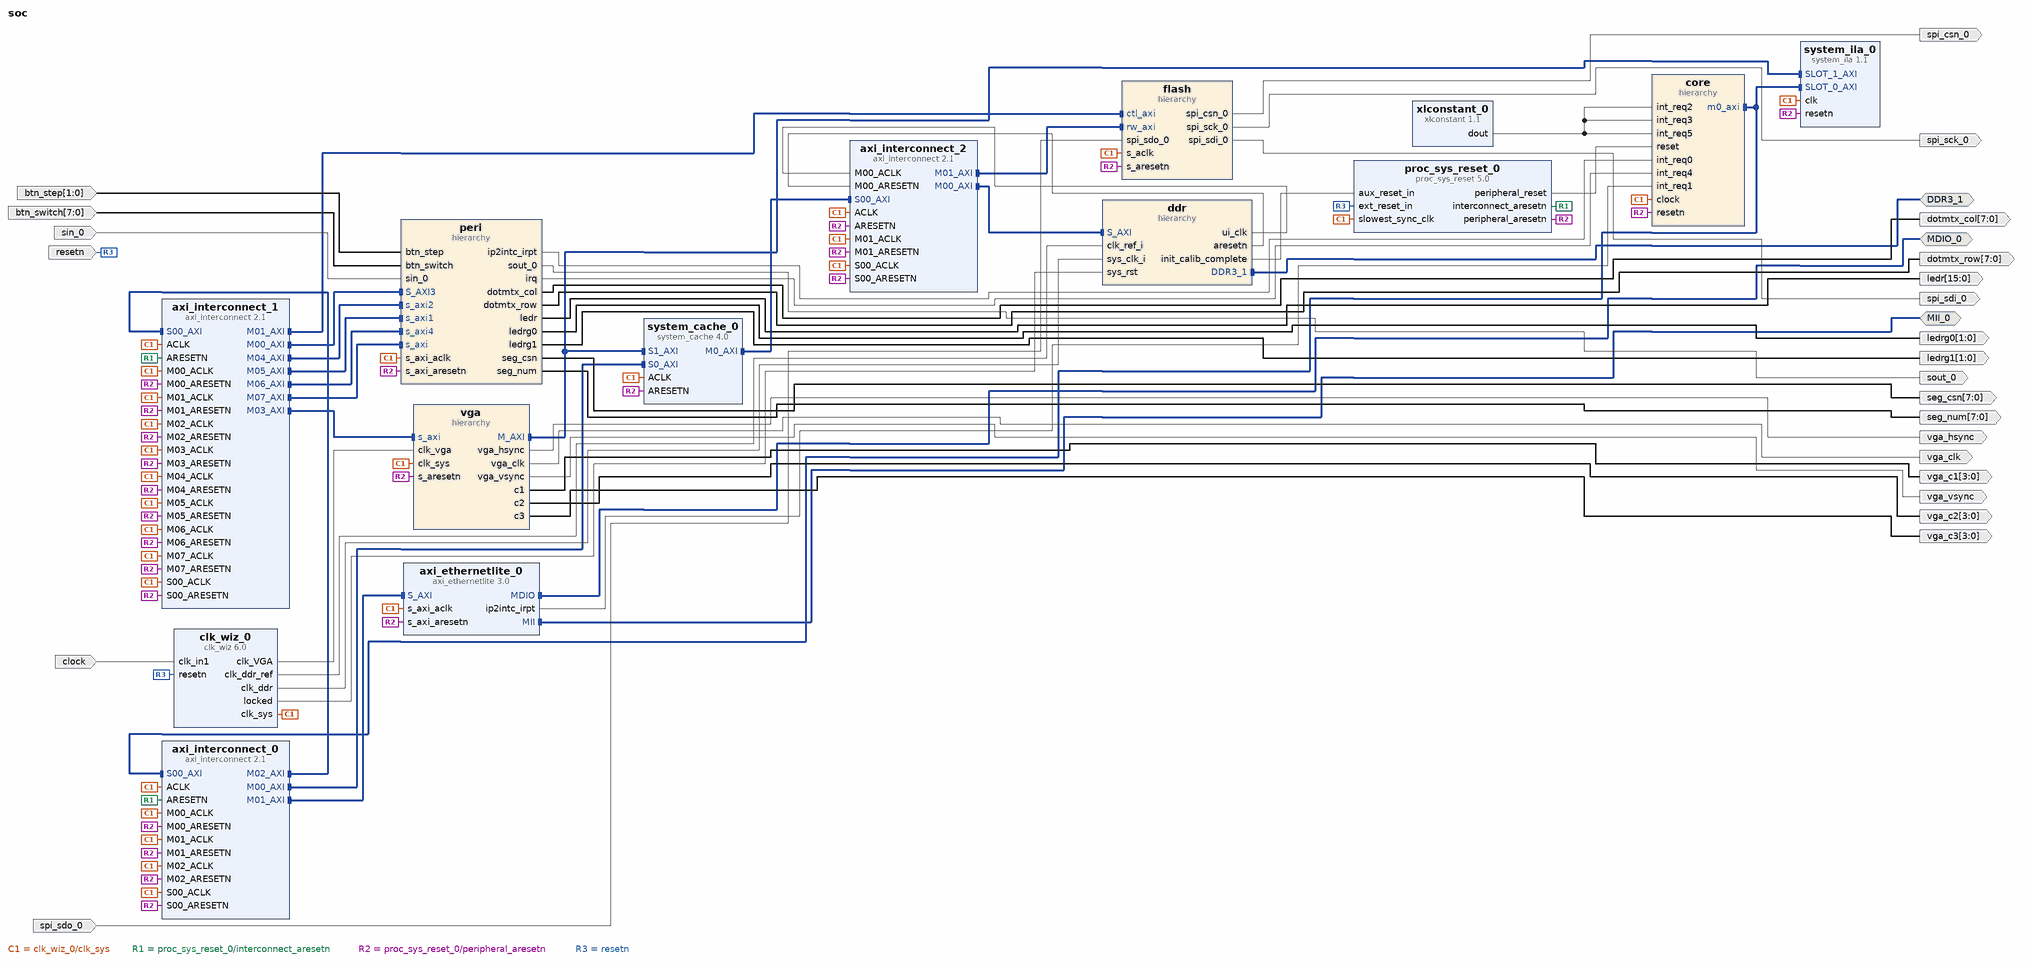
[diagram p0: block diagram of the top level]
# Vivado block design soc, xc7a200tfbg676-2, Vivado 2018.1
create_bd_design soc

create_bd_intf_port -mode Master -vlnv xilinx.com:interface:ddrx_rtl:1.0 DDR3_1
create_bd_intf_port -mode Master -vlnv xilinx.com:interface:mdio_rtl:1.0 MDIO_0
create_bd_intf_port -mode Master -vlnv xilinx.com:interface:mii_rtl:1.0 MII_0
create_bd_port -dir O vga_hsync
create_bd_port -dir O vga_clk
create_bd_port -dir O vga_vsync
create_bd_port -dir O sout_0
create_bd_port -dir I -from 1 -to 0 btn_step
create_bd_port -dir I -from 7 -to 0 btn_switch
create_bd_port -dir I -type clk clock
create_bd_port -dir O -from 7 -to 0 dotmtx_col
create_bd_port -dir O -from 7 -to 0 dotmtx_row
create_bd_port -dir O spi_csn_0
create_bd_port -dir O spi_sck_0
create_bd_port -dir O spi_sdi_0
create_bd_port -dir O -from 15 -to 0 ledr
create_bd_port -dir O -from 1 -to 0 ledrg0
create_bd_port -dir O -from 1 -to 0 ledrg1
create_bd_port -dir I -type rst resetn
create_bd_port -dir O -from 7 -to 0 seg_csn
create_bd_port -dir O -from 7 -to 0 seg_num
create_bd_port -dir I sin_0
create_bd_port -dir I spi_sdo_0
create_bd_port -dir O -from 3 -to 0 vga_c1
create_bd_port -dir O -from 3 -to 0 vga_c2
create_bd_port -dir O -from 3 -to 0 vga_c3

create_bd_cell -type ip -vlnv xilinx.com:ip:axi_ethernetlite:3.0 axi_ethernetlite_0
set_property -dict {CONFIG.C_S_AXI_PROTOCOL AXI4} [get_bd_cells axi_ethernetlite_0]
create_bd_cell -type ip -vlnv xilinx.com:ip:axi_interconnect:2.1 axi_interconnect_0
set_property -dict {CONFIG.NUM_MI 3 CONFIG.STRATEGY 2 CONFIG.S00_HAS_DATA_FIFO 2} [get_bd_cells axi_interconnect_0]
create_bd_cell -type ip -vlnv xilinx.com:ip:axi_interconnect:2.1 axi_interconnect_1
set_property -dict {CONFIG.NUM_MI 8 CONFIG.STRATEGY 1 CONFIG.ENABLE_ADVANCED_OPTIONS 1} [get_bd_cells axi_interconnect_1]
create_bd_cell -type ip -vlnv xilinx.com:ip:axi_interconnect:2.1 axi_interconnect_2
set_property -dict [list \
  CONFIG.STRATEGY 2 \
  CONFIG.ENABLE_ADVANCED_OPTIONS 0 \
  CONFIG.S00_HAS_DATA_FIFO 2 \
] [get_bd_cells axi_interconnect_2]
create_bd_cell -type ip -vlnv xilinx.com:ip:clk_wiz:6.0 clk_wiz_0
set_property -dict [list \
  CONFIG.CLKOUT1_USED true \
  CONFIG.CLKOUT2_USED true \
  CONFIG.CLKOUT3_USED true \
  CONFIG.CLKOUT4_USED true \
  CONFIG.NUM_OUT_CLKS 4 \
  CONFIG.CLK_OUT1_PORT clk_sys \
  CONFIG.CLK_OUT2_PORT clk_ddr_ref \
  CONFIG.CLK_OUT3_PORT clk_ddr \
  CONFIG.CLK_OUT4_PORT clk_VGA \
  CONFIG.CLKOUT1_REQUESTED_OUT_FREQ 50.000 \
  CONFIG.CLKOUT2_REQUESTED_OUT_FREQ 200.000 \
  CONFIG.CLKOUT3_REQUESTED_OUT_FREQ 100.000 \
  CONFIG.CLKOUT4_REQUESTED_OUT_FREQ 40 \
  CONFIG.RESET_PORT resetn \
  CONFIG.MMCM_DIVCLK_DIVIDE 1 \
  CONFIG.MMCM_CLKOUT0_DIVIDE_F 20.000 \
  CONFIG.MMCM_CLKOUT1_DIVIDE 5 \
  CONFIG.MMCM_CLKOUT2_DIVIDE 10 \
  CONFIG.MMCM_CLKOUT3_DIVIDE 25 \
  CONFIG.RESET_TYPE ACTIVE_LOW \
  CONFIG.CLKOUT1_JITTER 151.636 \
  CONFIG.CLKOUT2_JITTER 114.829 \
  CONFIG.CLKOUT2_PHASE_ERROR 98.575 \
  CONFIG.CLKOUT3_JITTER 130.958 \
  CONFIG.CLKOUT3_PHASE_ERROR 98.575 \
  CONFIG.CLKOUT4_JITTER 159.371 \
  CONFIG.CLKOUT4_PHASE_ERROR 98.575 \
] [get_bd_cells clk_wiz_0]
create_bd_cell -type hier core
create_bd_cell -type hier ddr
create_bd_cell -type hier flash
create_bd_cell -type hier peri
create_bd_cell -type ip -vlnv xilinx.com:ip:proc_sys_reset:5.0 proc_sys_reset_0
create_bd_cell -type ip -vlnv xilinx.com:ip:system_cache:4.0 system_cache_0
set_property -dict [list \
  CONFIG.C_ENABLE_CTRL 0 \
  CONFIG.C_NUM_OPTIMIZED_PORTS 2 \
  CONFIG.C_NUM_WAYS 4 \
  CONFIG.C_CACHE_DATA_WIDTH 128 \
  CONFIG.C_CACHE_SIZE 524288 \
  CONFIG.C_M0_AXI_DATA_WIDTH 128 \
  CONFIG.C_M1_AXI_DATA_WIDTH 32 \
  CONFIG.C_M2_AXI_DATA_WIDTH 32 \
  CONFIG.C_M3_AXI_DATA_WIDTH 32 \
] [get_bd_cells system_cache_0]
create_bd_cell -type ip -vlnv xilinx.com:ip:system_ila:1.1 system_ila_0
set_property -dict [list \
  CONFIG.C_DATA_DEPTH 4096 \
  CONFIG.C_PROBE0_MU_CNT 2 \
  CONFIG.ALL_PROBE_SAME_MU_CNT 2 \
  CONFIG.C_NUM_MONITOR_SLOTS 2 \
] [get_bd_cells system_ila_0]
create_bd_cell -type hier vga
create_bd_cell -type ip -vlnv xilinx.com:ip:xlconstant:1.1 xlconstant_0
set_property -dict {CONFIG.CONST_VAL 0} [get_bd_cells xlconstant_0]

# ---- hierarchy /core ----
current_bd_instance /core
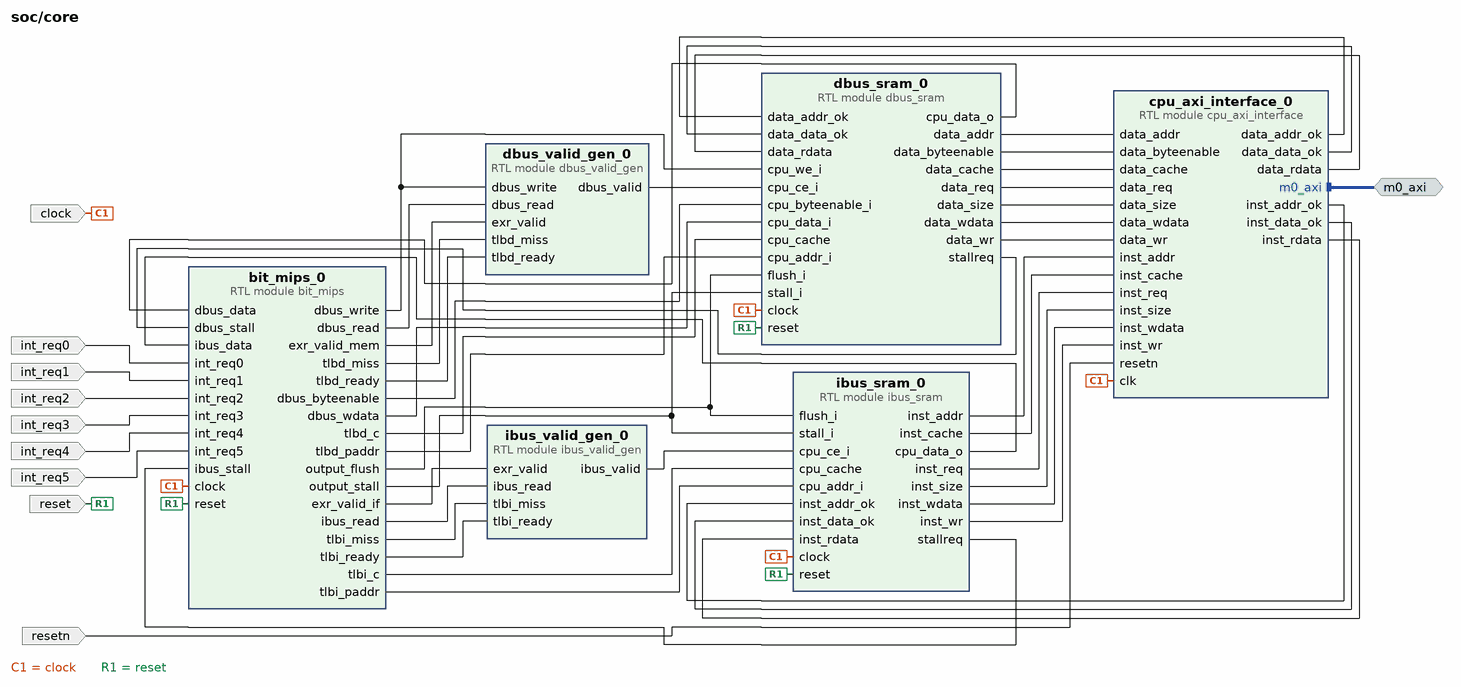
[diagram p1: block diagram inside /core]
create_bd_intf_pin -mode Master -vlnv xilinx.com:interface:aximm_rtl:1.0 m0_axi
create_bd_pin -dir I -type clk clock
create_bd_pin -dir I int_req0
create_bd_pin -dir I int_req1
create_bd_pin -dir I int_req2
create_bd_pin -dir I int_req3
create_bd_pin -dir I int_req4
create_bd_pin -dir I int_req5
create_bd_pin -dir I -type rst reset
create_bd_pin -dir I -type rst resetn

create_bd_cell -type module -reference bit_mips bit_mips_0
create_bd_cell -type module -reference cpu_axi_interface cpu_axi_interface_0
create_bd_cell -type module -reference dbus_sram dbus_sram_0
create_bd_cell -type module -reference dbus_valid_gen dbus_valid_gen_0
create_bd_cell -type module -reference ibus_sram ibus_sram_0
create_bd_cell -type module -reference ibus_valid_gen ibus_valid_gen_0

# ---- hierarchy /ddr ----
current_bd_instance /ddr
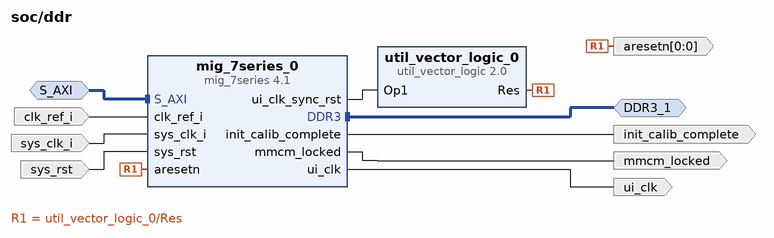
[diagram p2: block diagram inside /ddr]
create_bd_intf_pin -mode Master -vlnv xilinx.com:interface:ddrx_rtl:1.0 DDR3_1
create_bd_intf_pin -mode Slave -vlnv xilinx.com:interface:aximm_rtl:1.0 S_AXI
create_bd_pin -dir O -from 0 -to 0 -type rst aresetn
create_bd_pin -dir I -type clk clk_ref_i
create_bd_pin -dir O init_calib_complete
create_bd_pin -dir O mmcm_locked
create_bd_pin -dir I -type clk sys_clk_i
create_bd_pin -dir I -type rst sys_rst
create_bd_pin -dir O -type clk ui_clk

create_bd_cell -type ip -vlnv xilinx.com:ip:mig_7series:4.1 mig_7series_0
set_property -dict [list \
  CONFIG.XML_INPUT_FILE mig_a.prj \
  CONFIG.RESET_BOARD_INTERFACE Custom \
  CONFIG.BOARD_MIG_PARAM Custom \
] [get_bd_cells mig_7series_0]
create_bd_cell -type ip -vlnv xilinx.com:ip:util_vector_logic:2.0 util_vector_logic_0
set_property -dict {CONFIG.C_SIZE 1 CONFIG.C_OPERATION not} [get_bd_cells util_vector_logic_0]

# ---- hierarchy /flash ----
current_bd_instance /flash
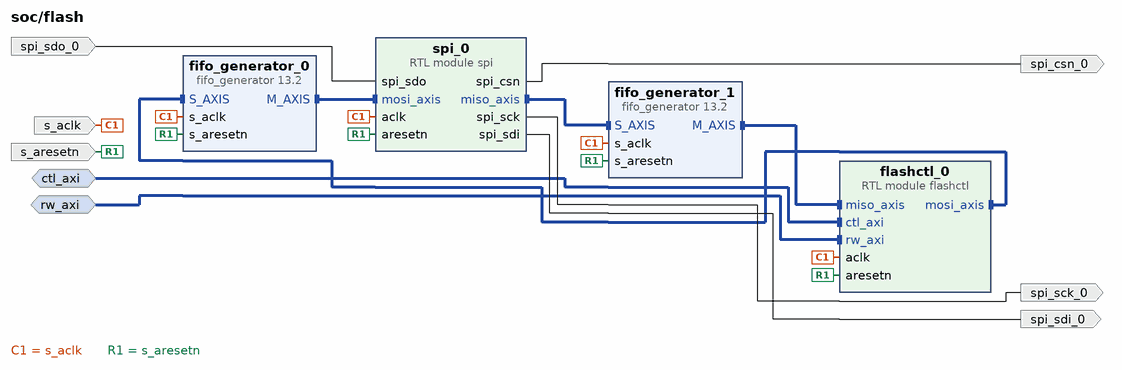
[diagram p3: block diagram inside /flash]
create_bd_intf_pin -mode Slave -vlnv xilinx.com:interface:aximm_rtl:1.0 ctl_axi
create_bd_intf_pin -mode Slave -vlnv xilinx.com:interface:aximm_rtl:1.0 rw_axi
create_bd_pin -dir I -type clk s_aclk
create_bd_pin -dir I -type rst s_aresetn
create_bd_pin -dir O spi_csn_0
create_bd_pin -dir O spi_sck_0
create_bd_pin -dir O spi_sdi_0
create_bd_pin -dir I spi_sdo_0

create_bd_cell -type ip -vlnv xilinx.com:ip:fifo_generator:13.2 fifo_generator_0
set_property -dict [list \
  CONFIG.INTERFACE_TYPE AXI_STREAM \
  CONFIG.Full_Flags_Reset_Value 1 \
  CONFIG.HAS_ACLKEN false \
  CONFIG.TUSER_WIDTH 0 \
  CONFIG.Enable_TLAST true \
  CONFIG.HAS_TSTRB true \
  CONFIG.FIFO_Implementation_wach Common_Clock_Distributed_RAM \
  CONFIG.FIFO_Implementation_wrch Common_Clock_Distributed_RAM \
  CONFIG.FIFO_Implementation_rach Common_Clock_Distributed_RAM \
  CONFIG.Enable_Safety_Circuit true \
] [get_bd_cells fifo_generator_0]
create_bd_cell -type ip -vlnv xilinx.com:ip:fifo_generator:13.2 fifo_generator_1
set_property -dict [list \
  CONFIG.INTERFACE_TYPE AXI_STREAM \
  CONFIG.Full_Flags_Reset_Value 1 \
  CONFIG.HAS_ACLKEN false \
  CONFIG.TUSER_WIDTH 0 \
  CONFIG.Enable_TLAST false \
  CONFIG.HAS_TSTRB false \
  CONFIG.FIFO_Implementation_wach Common_Clock_Distributed_RAM \
  CONFIG.FIFO_Implementation_wrch Common_Clock_Distributed_RAM \
  CONFIG.FIFO_Implementation_rach Common_Clock_Distributed_RAM \
  CONFIG.Enable_Safety_Circuit true \
] [get_bd_cells fifo_generator_1]
create_bd_cell -type module -reference flashctl flashctl_0
create_bd_cell -type module -reference spi spi_0

# ---- hierarchy /peri ----
current_bd_instance /peri
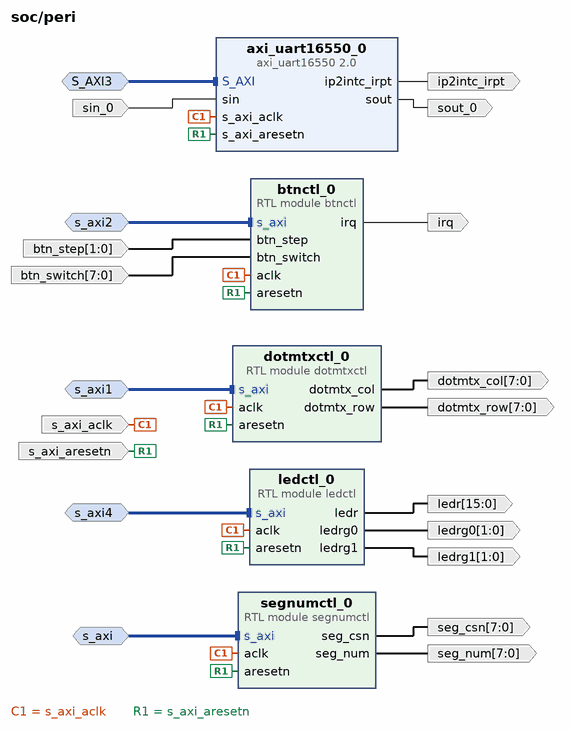
[diagram p4: block diagram inside /peri]
create_bd_intf_pin -mode Slave -vlnv xilinx.com:interface:aximm_rtl:1.0 S_AXI3
create_bd_intf_pin -mode Slave -vlnv xilinx.com:interface:aximm_rtl:1.0 s_axi
create_bd_intf_pin -mode Slave -vlnv xilinx.com:interface:aximm_rtl:1.0 s_axi1
create_bd_intf_pin -mode Slave -vlnv xilinx.com:interface:aximm_rtl:1.0 s_axi2
create_bd_intf_pin -mode Slave -vlnv xilinx.com:interface:aximm_rtl:1.0 s_axi4
create_bd_pin -dir I -from 1 -to 0 btn_step
create_bd_pin -dir I -from 7 -to 0 btn_switch
create_bd_pin -dir O -from 7 -to 0 dotmtx_col
create_bd_pin -dir O -from 7 -to 0 dotmtx_row
create_bd_pin -dir O -type intr ip2intc_irpt
create_bd_pin -dir O -type intr irq
create_bd_pin -dir O -from 15 -to 0 ledr
create_bd_pin -dir O -from 1 -to 0 ledrg0
create_bd_pin -dir O -from 1 -to 0 ledrg1
create_bd_pin -dir I -type clk s_axi_aclk
create_bd_pin -dir I -type rst s_axi_aresetn
create_bd_pin -dir O -from 7 -to 0 seg_csn
create_bd_pin -dir O -from 7 -to 0 seg_num
create_bd_pin -dir I sin_0
create_bd_pin -dir O sout_0

create_bd_cell -type ip -vlnv xilinx.com:ip:axi_uart16550:2.0 axi_uart16550_0
create_bd_cell -type module -reference btnctl btnctl_0
create_bd_cell -type module -reference dotmtxctl dotmtxctl_0
create_bd_cell -type module -reference ledctl ledctl_0
create_bd_cell -type module -reference segnumctl segnumctl_0

# ---- hierarchy /vga ----
current_bd_instance /vga
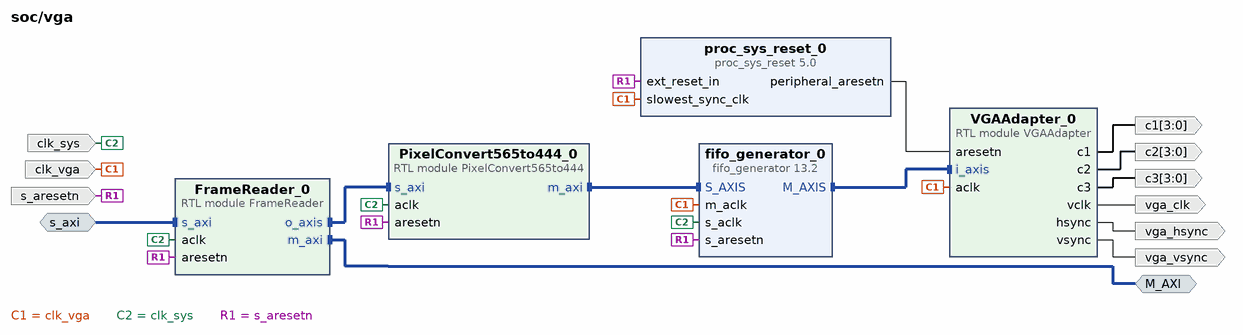
[diagram p5: block diagram inside /vga]
create_bd_intf_pin -mode Master -vlnv xilinx.com:interface:aximm_rtl:1.0 M_AXI
create_bd_intf_pin -mode Slave -vlnv xilinx.com:interface:aximm_rtl:1.0 s_axi
create_bd_pin -dir O -from 3 -to 0 c1
create_bd_pin -dir O -from 3 -to 0 c2
create_bd_pin -dir O -from 3 -to 0 c3
create_bd_pin -dir I -type clk clk_sys
create_bd_pin -dir I -type clk clk_vga
create_bd_pin -dir I -type rst s_aresetn
create_bd_pin -dir O vga_clk
create_bd_pin -dir O vga_hsync
create_bd_pin -dir O vga_vsync

create_bd_cell -type module -reference FrameReader FrameReader_0
set_property -dict {CONFIG.READ_WIDTH 128} [get_bd_cells FrameReader_0]
create_bd_cell -type module -reference PixelConvert565to444 PixelConvert565to444_0
create_bd_cell -type module -reference VGAAdapter VGAAdapter_0
set_property -dict [list \
  CONFIG.COLOR1_WIDTH 4 \
  CONFIG.COLOR2_WIDTH 4 \
  CONFIG.COLOR3_WIDTH 4 \
  CONFIG.FILL_WIDTH 4 \
] [get_bd_cells VGAAdapter_0]
create_bd_cell -type ip -vlnv xilinx.com:ip:fifo_generator:13.2 fifo_generator_0
set_property -dict [list \
  CONFIG.INTERFACE_TYPE AXI_STREAM \
  CONFIG.Full_Flags_Reset_Value 1 \
  CONFIG.Clock_Type_AXI Independent_Clock \
  CONFIG.TDATA_NUM_BYTES 2 \
  CONFIG.TUSER_WIDTH 0 \
  CONFIG.Enable_TLAST true \
  CONFIG.FIFO_Implementation_wach Independent_Clocks_Distributed_RAM \
  CONFIG.FIFO_Implementation_wdch Independent_Clocks_Block_RAM \
  CONFIG.FIFO_Implementation_wrch Independent_Clocks_Distributed_RAM \
  CONFIG.FIFO_Implementation_rach Independent_Clocks_Distributed_RAM \
  CONFIG.FIFO_Implementation_rdch Independent_Clocks_Block_RAM \
  CONFIG.FIFO_Implementation_axis Independent_Clocks_Block_RAM \
  CONFIG.Input_Depth_axis 8192 \
  CONFIG.Underflow_Flag_AXI false \
  CONFIG.Enable_Safety_Circuit true \
] [get_bd_cells fifo_generator_0]
create_bd_cell -type ip -vlnv xilinx.com:ip:proc_sys_reset:5.0 proc_sys_reset_0

# ---- connections ----

current_bd_instance /core
connect_bd_intf_net [get_bd_intf_pins m0_axi] [get_bd_intf_pins cpu_axi_interface_0/m0_axi]
connect_bd_net [get_bd_pins bit_mips_0/dbus_byteenable] [get_bd_pins dbus_sram_0/cpu_byteenable_i]
connect_bd_net [get_bd_pins bit_mips_0/dbus_read] [get_bd_pins dbus_valid_gen_0/dbus_read]
connect_bd_net [get_bd_pins bit_mips_0/dbus_wdata] [get_bd_pins dbus_sram_0/cpu_data_i]
connect_bd_net [get_bd_pins bit_mips_0/dbus_write] [get_bd_pins dbus_sram_0/cpu_we_i] [get_bd_pins dbus_valid_gen_0/dbus_write]
connect_bd_net [get_bd_pins bit_mips_0/exr_valid_if] [get_bd_pins ibus_valid_gen_0/exr_valid]
connect_bd_net [get_bd_pins bit_mips_0/exr_valid_mem] [get_bd_pins dbus_valid_gen_0/exr_valid]
connect_bd_net [get_bd_pins bit_mips_0/ibus_read] [get_bd_pins ibus_valid_gen_0/ibus_read]
connect_bd_net [get_bd_pins bit_mips_0/output_flush] [get_bd_pins dbus_sram_0/flush_i] [get_bd_pins ibus_sram_0/flush_i]
connect_bd_net [get_bd_pins bit_mips_0/output_stall] [get_bd_pins dbus_sram_0/stall_i] [get_bd_pins ibus_sram_0/stall_i]
connect_bd_net [get_bd_pins bit_mips_0/tlbd_c] [get_bd_pins dbus_sram_0/cpu_cache]
connect_bd_net [get_bd_pins bit_mips_0/tlbd_miss] [get_bd_pins dbus_valid_gen_0/tlbd_miss]
connect_bd_net [get_bd_pins bit_mips_0/tlbd_paddr] [get_bd_pins dbus_sram_0/cpu_addr_i]
connect_bd_net [get_bd_pins bit_mips_0/tlbd_ready] [get_bd_pins dbus_valid_gen_0/tlbd_ready]
connect_bd_net [get_bd_pins bit_mips_0/tlbi_c] [get_bd_pins ibus_sram_0/cpu_cache]
connect_bd_net [get_bd_pins bit_mips_0/tlbi_miss] [get_bd_pins ibus_valid_gen_0/tlbi_miss]
connect_bd_net [get_bd_pins bit_mips_0/tlbi_paddr] [get_bd_pins ibus_sram_0/cpu_addr_i]
connect_bd_net [get_bd_pins bit_mips_0/tlbi_ready] [get_bd_pins ibus_valid_gen_0/tlbi_ready]
connect_bd_net -net clk_wiz_0_clk_sys [get_bd_pins clock] \
  [get_bd_pins bit_mips_0/clock] [get_bd_pins cpu_axi_interface_0/clk] [get_bd_pins dbus_sram_0/clock] \
  [get_bd_pins ibus_sram_0/clock]
connect_bd_net [get_bd_pins cpu_axi_interface_0/data_addr_ok] [get_bd_pins dbus_sram_0/data_addr_ok]
connect_bd_net [get_bd_pins cpu_axi_interface_0/data_data_ok] [get_bd_pins dbus_sram_0/data_data_ok]
connect_bd_net [get_bd_pins cpu_axi_interface_0/data_rdata] [get_bd_pins dbus_sram_0/data_rdata]
connect_bd_net [get_bd_pins cpu_axi_interface_0/inst_addr_ok] [get_bd_pins ibus_sram_0/inst_addr_ok]
connect_bd_net [get_bd_pins cpu_axi_interface_0/inst_data_ok] [get_bd_pins ibus_sram_0/inst_data_ok]
connect_bd_net [get_bd_pins cpu_axi_interface_0/inst_rdata] [get_bd_pins ibus_sram_0/inst_rdata]
connect_bd_net [get_bd_pins dbus_sram_0/cpu_data_o] [get_bd_pins bit_mips_0/dbus_data]
connect_bd_net [get_bd_pins dbus_sram_0/data_addr] [get_bd_pins cpu_axi_interface_0/data_addr]
connect_bd_net [get_bd_pins dbus_sram_0/data_byteenable] [get_bd_pins cpu_axi_interface_0/data_byteenable]
connect_bd_net [get_bd_pins dbus_sram_0/data_cache] [get_bd_pins cpu_axi_interface_0/data_cache]
connect_bd_net [get_bd_pins dbus_sram_0/data_req] [get_bd_pins cpu_axi_interface_0/data_req]
connect_bd_net [get_bd_pins dbus_sram_0/data_size] [get_bd_pins cpu_axi_interface_0/data_size]
connect_bd_net [get_bd_pins dbus_sram_0/data_wdata] [get_bd_pins cpu_axi_interface_0/data_wdata]
connect_bd_net [get_bd_pins dbus_sram_0/data_wr] [get_bd_pins cpu_axi_interface_0/data_wr]
connect_bd_net [get_bd_pins dbus_sram_0/stallreq] [get_bd_pins bit_mips_0/dbus_stall]
connect_bd_net [get_bd_pins dbus_valid_gen_0/dbus_valid] [get_bd_pins dbus_sram_0/cpu_ce_i]
connect_bd_net [get_bd_pins ibus_sram_0/cpu_data_o] [get_bd_pins bit_mips_0/ibus_data]
connect_bd_net [get_bd_pins ibus_sram_0/inst_addr] [get_bd_pins cpu_axi_interface_0/inst_addr]
connect_bd_net [get_bd_pins ibus_sram_0/inst_cache] [get_bd_pins cpu_axi_interface_0/inst_cache]
connect_bd_net [get_bd_pins ibus_sram_0/inst_req] [get_bd_pins cpu_axi_interface_0/inst_req]
connect_bd_net [get_bd_pins ibus_sram_0/inst_size] [get_bd_pins cpu_axi_interface_0/inst_size]
connect_bd_net [get_bd_pins ibus_sram_0/inst_wdata] [get_bd_pins cpu_axi_interface_0/inst_wdata]
connect_bd_net [get_bd_pins ibus_sram_0/inst_wr] [get_bd_pins cpu_axi_interface_0/inst_wr]
connect_bd_net [get_bd_pins ibus_sram_0/stallreq] [get_bd_pins bit_mips_0/ibus_stall]
connect_bd_net [get_bd_pins ibus_valid_gen_0/ibus_valid] [get_bd_pins ibus_sram_0/cpu_ce_i]
connect_bd_net -net int_req0_0_1 [get_bd_pins int_req0] [get_bd_pins bit_mips_0/int_req0]
connect_bd_net -net int_req1_0_1 [get_bd_pins int_req1] [get_bd_pins bit_mips_0/int_req1]
connect_bd_net -net int_req2_0_1 [get_bd_pins int_req2] [get_bd_pins bit_mips_0/int_req2]
connect_bd_net -net int_req3_0_1 [get_bd_pins int_req3] [get_bd_pins bit_mips_0/int_req3]
connect_bd_net -net int_req4_0_1 [get_bd_pins int_req4] [get_bd_pins bit_mips_0/int_req4]
connect_bd_net -net int_req5_0_1 [get_bd_pins int_req5] [get_bd_pins bit_mips_0/int_req5]
connect_bd_net -net proc_sys_reset_0_peripheral_reset [get_bd_pins reset] \
  [get_bd_pins bit_mips_0/reset] [get_bd_pins dbus_sram_0/reset] [get_bd_pins ibus_sram_0/reset]
connect_bd_net [get_bd_pins resetn] [get_bd_pins cpu_axi_interface_0/resetn]

current_bd_instance /ddr
connect_bd_intf_net [get_bd_intf_pins DDR3_1] [get_bd_intf_pins mig_7series_0/DDR3]
connect_bd_intf_net [get_bd_intf_pins S_AXI] [get_bd_intf_pins mig_7series_0/S_AXI]
connect_bd_net [get_bd_pins clk_ref_i] [get_bd_pins mig_7series_0/clk_ref_i]
connect_bd_net [get_bd_pins mig_7series_0/init_calib_complete] [get_bd_pins init_calib_complete]
connect_bd_net [get_bd_pins mig_7series_0/mmcm_locked] [get_bd_pins mmcm_locked]
connect_bd_net [get_bd_pins mig_7series_0/ui_clk] [get_bd_pins ui_clk]
connect_bd_net [get_bd_pins mig_7series_0/ui_clk_sync_rst] [get_bd_pins util_vector_logic_0/Op1]
connect_bd_net [get_bd_pins sys_clk_i] [get_bd_pins mig_7series_0/sys_clk_i]
connect_bd_net [get_bd_pins sys_rst] [get_bd_pins mig_7series_0/sys_rst]
connect_bd_net [get_bd_pins util_vector_logic_0/Res] [get_bd_pins aresetn] [get_bd_pins mig_7series_0/aresetn]

current_bd_instance /flash
connect_bd_intf_net [get_bd_intf_pins fifo_generator_0/M_AXIS] [get_bd_intf_pins spi_0/mosi_axis]
connect_bd_intf_net [get_bd_intf_pins fifo_generator_1/M_AXIS] [get_bd_intf_pins flashctl_0/miso_axis]
connect_bd_intf_net [get_bd_intf_pins fifo_generator_0/S_AXIS] [get_bd_intf_pins flashctl_0/mosi_axis]
connect_bd_intf_net [get_bd_intf_pins fifo_generator_1/S_AXIS] [get_bd_intf_pins spi_0/miso_axis]
connect_bd_intf_net -intf_net axi_interconnect_1_M01_AXI [get_bd_intf_pins ctl_axi] [get_bd_intf_pins flashctl_0/ctl_axi]
connect_bd_intf_net -intf_net axi_interconnect_1_M02_AXI [get_bd_intf_pins rw_axi] [get_bd_intf_pins flashctl_0/rw_axi]
connect_bd_net -net clk_wiz_0_clk_sys [get_bd_pins s_aclk] \
  [get_bd_pins fifo_generator_0/s_aclk] [get_bd_pins fifo_generator_1/s_aclk] [get_bd_pins flashctl_0/aclk] \
  [get_bd_pins spi_0/aclk]
connect_bd_net -net proc_sys_reset_0_peripheral_aresetn [get_bd_pins s_aresetn] \
  [get_bd_pins fifo_generator_0/s_aresetn] [get_bd_pins fifo_generator_1/s_aresetn] [get_bd_pins flashctl_0/aresetn] \
  [get_bd_pins spi_0/aresetn]
connect_bd_net [get_bd_pins spi_0/spi_csn] [get_bd_pins spi_csn_0]
connect_bd_net [get_bd_pins spi_0/spi_sck] [get_bd_pins spi_sck_0]
connect_bd_net [get_bd_pins spi_0/spi_sdi] [get_bd_pins spi_sdi_0]
connect_bd_net -net spi_sdo_0_1 [get_bd_pins spi_sdo_0] [get_bd_pins spi_0/spi_sdo]

current_bd_instance /peri
connect_bd_intf_net -intf_net axi_interconnect_1_M00_AXI [get_bd_intf_pins S_AXI3] [get_bd_intf_pins axi_uart16550_0/S_AXI]
connect_bd_intf_net -intf_net axi_interconnect_1_M07_AXI [get_bd_intf_pins s_axi] [get_bd_intf_pins segnumctl_0/s_axi]
connect_bd_intf_net -intf_net axi_interconnect_1_M05_AXI [get_bd_intf_pins s_axi1] [get_bd_intf_pins dotmtxctl_0/s_axi]
connect_bd_intf_net -intf_net axi_interconnect_1_M04_AXI [get_bd_intf_pins s_axi2] [get_bd_intf_pins btnctl_0/s_axi]
connect_bd_intf_net -intf_net axi_interconnect_1_M06_AXI [get_bd_intf_pins s_axi4] [get_bd_intf_pins ledctl_0/s_axi]
connect_bd_net [get_bd_pins axi_uart16550_0/ip2intc_irpt] [get_bd_pins ip2intc_irpt]
connect_bd_net [get_bd_pins axi_uart16550_0/sout] [get_bd_pins sout_0]
connect_bd_net -net btn_step_0_1 [get_bd_pins btn_step] [get_bd_pins btnctl_0/btn_step]
connect_bd_net -net btn_switch_0_1 [get_bd_pins btn_switch] [get_bd_pins btnctl_0/btn_switch]
connect_bd_net [get_bd_pins btnctl_0/irq] [get_bd_pins irq]
connect_bd_net -net clk_wiz_0_clk_sys [get_bd_pins s_axi_aclk] \
  [get_bd_pins axi_uart16550_0/s_axi_aclk] [get_bd_pins btnctl_0/aclk] [get_bd_pins dotmtxctl_0/aclk] \
  [get_bd_pins ledctl_0/aclk] [get_bd_pins segnumctl_0/aclk]
connect_bd_net [get_bd_pins dotmtxctl_0/dotmtx_col] [get_bd_pins dotmtx_col]
connect_bd_net [get_bd_pins dotmtxctl_0/dotmtx_row] [get_bd_pins dotmtx_row]
connect_bd_net [get_bd_pins ledctl_0/ledr] [get_bd_pins ledr]
connect_bd_net [get_bd_pins ledctl_0/ledrg0] [get_bd_pins ledrg0]
connect_bd_net [get_bd_pins ledctl_0/ledrg1] [get_bd_pins ledrg1]
connect_bd_net -net proc_sys_reset_0_peripheral_aresetn [get_bd_pins s_axi_aresetn] \
  [get_bd_pins axi_uart16550_0/s_axi_aresetn] [get_bd_pins btnctl_0/aresetn] [get_bd_pins dotmtxctl_0/aresetn] \
  [get_bd_pins ledctl_0/aresetn] [get_bd_pins segnumctl_0/aresetn]
connect_bd_net [get_bd_pins segnumctl_0/seg_csn] [get_bd_pins seg_csn]
connect_bd_net [get_bd_pins segnumctl_0/seg_num] [get_bd_pins seg_num]
connect_bd_net -net sin_0_1 [get_bd_pins sin_0] [get_bd_pins axi_uart16550_0/sin]

current_bd_instance /vga
connect_bd_intf_net [get_bd_intf_pins FrameReader_0/o_axis] [get_bd_intf_pins PixelConvert565to444_0/s_axi]
connect_bd_intf_net [get_bd_intf_pins PixelConvert565to444_0/m_axi] [get_bd_intf_pins fifo_generator_0/S_AXIS]
connect_bd_intf_net [get_bd_intf_pins VGAAdapter_0/i_axis] [get_bd_intf_pins fifo_generator_0/M_AXIS]
connect_bd_intf_net [get_bd_intf_pins M_AXI] [get_bd_intf_pins FrameReader_0/m_axi]
connect_bd_intf_net -intf_net axi_interconnect_1_M03_AXI [get_bd_intf_pins s_axi] [get_bd_intf_pins FrameReader_0/s_axi]
connect_bd_net [get_bd_pins VGAAdapter_0/c1] [get_bd_pins c1]
connect_bd_net [get_bd_pins VGAAdapter_0/c2] [get_bd_pins c2]
connect_bd_net [get_bd_pins VGAAdapter_0/c3] [get_bd_pins c3]
connect_bd_net [get_bd_pins VGAAdapter_0/hsync] [get_bd_pins vga_hsync]
connect_bd_net [get_bd_pins VGAAdapter_0/vclk] [get_bd_pins vga_clk]
connect_bd_net [get_bd_pins VGAAdapter_0/vsync] [get_bd_pins vga_vsync]
connect_bd_net -net aclk_1 [get_bd_pins clk_vga] \
  [get_bd_pins VGAAdapter_0/aclk] [get_bd_pins fifo_generator_0/m_aclk] [get_bd_pins proc_sys_reset_0/slowest_sync_clk]
connect_bd_net -net clk_wiz_0_clk_sys [get_bd_pins clk_sys] \
  [get_bd_pins FrameReader_0/aclk] [get_bd_pins PixelConvert565to444_0/aclk] [get_bd_pins fifo_generator_0/s_aclk]
connect_bd_net -net proc_sys_reset_0_peripheral_aresetn [get_bd_pins s_aresetn] \
  [get_bd_pins FrameReader_0/aresetn] [get_bd_pins PixelConvert565to444_0/aresetn] [get_bd_pins fifo_generator_0/s_aresetn] \
  [get_bd_pins proc_sys_reset_0/ext_reset_in]
connect_bd_net [get_bd_pins proc_sys_reset_0/peripheral_aresetn] [get_bd_pins VGAAdapter_0/aresetn]

current_bd_instance /
connect_bd_intf_net -intf_net FrameReader_0_M_AXI [get_bd_intf_pins system_cache_0/S1_AXI] [get_bd_intf_pins vga/M_AXI]
connect_bd_intf_net [get_bd_intf_pins system_cache_0/S1_AXI] [get_bd_intf_pins system_ila_0/SLOT_1_AXI]
connect_bd_intf_net [get_bd_intf_pins axi_interconnect_2/S00_AXI] [get_bd_intf_pins system_cache_0/M0_AXI]
connect_bd_intf_net [get_bd_intf_pins axi_interconnect_0/M00_AXI] [get_bd_intf_pins system_cache_0/S0_AXI]
connect_bd_intf_net [get_bd_intf_pins axi_ethernetlite_0/S_AXI] [get_bd_intf_pins axi_interconnect_0/M01_AXI]
connect_bd_intf_net [get_bd_intf_pins axi_interconnect_0/M02_AXI] [get_bd_intf_pins axi_interconnect_1/S00_AXI]
connect_bd_intf_net [get_bd_intf_pins axi_interconnect_1/M00_AXI] [get_bd_intf_pins peri/S_AXI3]
connect_bd_intf_net [get_bd_intf_pins axi_interconnect_1/M01_AXI] [get_bd_intf_pins flash/ctl_axi]
connect_bd_intf_net [get_bd_intf_pins axi_interconnect_1/M03_AXI] [get_bd_intf_pins vga/s_axi]
connect_bd_intf_net [get_bd_intf_pins axi_interconnect_1/M04_AXI] [get_bd_intf_pins peri/s_axi2]
connect_bd_intf_net [get_bd_intf_pins axi_interconnect_1/M05_AXI] [get_bd_intf_pins peri/s_axi1]
connect_bd_intf_net [get_bd_intf_pins axi_interconnect_1/M06_AXI] [get_bd_intf_pins peri/s_axi4]
connect_bd_intf_net [get_bd_intf_pins axi_interconnect_1/M07_AXI] [get_bd_intf_pins peri/s_axi]
connect_bd_intf_net [get_bd_intf_pins axi_interconnect_2/M00_AXI] [get_bd_intf_pins ddr/S_AXI]
connect_bd_intf_net [get_bd_intf_pins axi_interconnect_2/M01_AXI] [get_bd_intf_pins flash/rw_axi]
connect_bd_intf_net [get_bd_intf_pins axi_interconnect_0/S00_AXI] [get_bd_intf_pins core/m0_axi]
connect_bd_intf_net [get_bd_intf_pins axi_interconnect_0/S00_AXI] [get_bd_intf_pins system_ila_0/SLOT_0_AXI]
connect_bd_intf_net [get_bd_intf_ports DDR3_1] [get_bd_intf_pins ddr/DDR3_1]
connect_bd_intf_net [get_bd_intf_ports MDIO_0] [get_bd_intf_pins axi_ethernetlite_0/MDIO]
connect_bd_intf_net [get_bd_intf_ports MII_0] [get_bd_intf_pins axi_ethernetlite_0/MII]
connect_bd_net -net M00_ACLK_1 [get_bd_pins ddr/ui_clk] [get_bd_pins axi_interconnect_2/M00_ACLK]
connect_bd_net -net M00_ARESETN_1 [get_bd_pins ddr/aresetn] [get_bd_pins axi_interconnect_2/M00_ARESETN]
connect_bd_net -net VGAAdapter_0_hsync [get_bd_pins vga/vga_hsync] [get_bd_ports vga_hsync]
connect_bd_net -net VGAAdapter_0_vclk [get_bd_pins vga/vga_clk] [get_bd_ports vga_clk]
connect_bd_net -net VGAAdapter_0_vsync [get_bd_pins vga/vga_vsync] [get_bd_ports vga_vsync]
connect_bd_net [get_bd_pins axi_ethernetlite_0/ip2intc_irpt] [get_bd_pins core/int_req1]
connect_bd_net -net axi_uart16550_0_ip2intc_irpt [get_bd_pins peri/ip2intc_irpt] [get_bd_pins core/int_req0]
connect_bd_net -net axi_uart16550_0_sout [get_bd_pins peri/sout_0] [get_bd_ports sout_0]
connect_bd_net -net btn_step_0_1 [get_bd_ports btn_step] [get_bd_pins peri/btn_step]
connect_bd_net -net btn_switch_0_1 [get_bd_ports btn_switch] [get_bd_pins peri/btn_switch]
connect_bd_net -net btnctl_0_irq [get_bd_pins peri/irq] [get_bd_pins core/int_req4]
connect_bd_net -net clk_ref_i_1 [get_bd_pins clk_wiz_0/clk_ddr_ref] [get_bd_pins ddr/clk_ref_i]
connect_bd_net [get_bd_pins clk_wiz_0/clk_VGA] [get_bd_pins vga/clk_vga]
connect_bd_net [get_bd_pins clk_wiz_0/clk_ddr] [get_bd_pins ddr/sys_clk_i]
connect_bd_net [get_bd_pins clk_wiz_0/clk_sys] \
  [get_bd_pins axi_ethernetlite_0/s_axi_aclk] [get_bd_pins proc_sys_reset_0/slowest_sync_clk] \
  [get_bd_pins system_cache_0/ACLK] [get_bd_pins system_ila_0/clk] [get_bd_pins axi_interconnect_0/ACLK] \
  [get_bd_pins axi_interconnect_0/M00_ACLK] [get_bd_pins axi_interconnect_0/M01_ACLK] \
  [get_bd_pins axi_interconnect_0/M02_ACLK] [get_bd_pins axi_interconnect_0/S00_ACLK] [get_bd_pins axi_interconnect_1/ACLK] \
  [get_bd_pins axi_interconnect_1/M00_ACLK] [get_bd_pins axi_interconnect_1/M01_ACLK] \
  [get_bd_pins axi_interconnect_1/M02_ACLK] [get_bd_pins axi_interconnect_1/M03_ACLK] \
  [get_bd_pins axi_interconnect_1/M04_ACLK] [get_bd_pins axi_interconnect_1/M05_ACLK] \
  [get_bd_pins axi_interconnect_1/M06_ACLK] [get_bd_pins axi_interconnect_1/M07_ACLK] \
  [get_bd_pins axi_interconnect_1/S00_ACLK] [get_bd_pins axi_interconnect_2/ACLK] [get_bd_pins axi_interconnect_2/M01_ACLK] \
  [get_bd_pins axi_interconnect_2/S00_ACLK] [get_bd_pins core/clock] [get_bd_pins flash/s_aclk] [get_bd_pins peri/s_axi_aclk] \
  [get_bd_pins vga/clk_sys]
connect_bd_net [get_bd_pins clk_wiz_0/locked] [get_bd_pins ddr/sys_rst]
connect_bd_net [get_bd_ports clock] [get_bd_pins clk_wiz_0/clk_in1]
connect_bd_net [get_bd_pins ddr/init_calib_complete] [get_bd_pins proc_sys_reset_0/aux_reset_in]
connect_bd_net -net dotmtxctl_0_dotmtx_col [get_bd_pins peri/dotmtx_col] [get_bd_ports dotmtx_col]
connect_bd_net -net dotmtxctl_0_dotmtx_row [get_bd_pins peri/dotmtx_row] [get_bd_ports dotmtx_row]
connect_bd_net [get_bd_pins flash/spi_csn_0] [get_bd_ports spi_csn_0]
connect_bd_net [get_bd_pins flash/spi_sck_0] [get_bd_ports spi_sck_0]
connect_bd_net [get_bd_pins flash/spi_sdi_0] [get_bd_ports spi_sdi_0]
connect_bd_net -net ledctl_0_ledr [get_bd_pins peri/ledr] [get_bd_ports ledr]
connect_bd_net -net ledctl_0_ledrg0 [get_bd_pins peri/ledrg0] [get_bd_ports ledrg0]
connect_bd_net -net ledctl_0_ledrg1 [get_bd_pins peri/ledrg1] [get_bd_ports ledrg1]
connect_bd_net [get_bd_pins proc_sys_reset_0/interconnect_aresetn] [get_bd_pins axi_interconnect_0/ARESETN] [get_bd_pins axi_interconnect_1/ARESETN]
connect_bd_net [get_bd_pins proc_sys_reset_0/peripheral_aresetn] \
  [get_bd_pins axi_ethernetlite_0/s_axi_aresetn] [get_bd_pins system_cache_0/ARESETN] [get_bd_pins system_ila_0/resetn] \
  [get_bd_pins axi_interconnect_0/M00_ARESETN] [get_bd_pins axi_interconnect_0/M01_ARESETN] \
  [get_bd_pins axi_interconnect_0/M02_ARESETN] [get_bd_pins axi_interconnect_0/S00_ARESETN] \
  [get_bd_pins axi_interconnect_1/M00_ARESETN] [get_bd_pins axi_interconnect_1/M01_ARESETN] \
  [get_bd_pins axi_interconnect_1/M02_ARESETN] [get_bd_pins axi_interconnect_1/M03_ARESETN] \
  [get_bd_pins axi_interconnect_1/M04_ARESETN] [get_bd_pins axi_interconnect_1/M05_ARESETN] \
  [get_bd_pins axi_interconnect_1/M06_ARESETN] [get_bd_pins axi_interconnect_1/M07_ARESETN] \
  [get_bd_pins axi_interconnect_1/S00_ARESETN] [get_bd_pins axi_interconnect_2/ARESETN] \
  [get_bd_pins axi_interconnect_2/M01_ARESETN] [get_bd_pins axi_interconnect_2/S00_ARESETN] [get_bd_pins core/resetn] \
  [get_bd_pins flash/s_aresetn] [get_bd_pins peri/s_axi_aresetn] [get_bd_pins vga/s_aresetn]
connect_bd_net [get_bd_pins proc_sys_reset_0/peripheral_reset] [get_bd_pins core/reset]
connect_bd_net [get_bd_ports resetn] [get_bd_pins clk_wiz_0/resetn] [get_bd_pins proc_sys_reset_0/ext_reset_in]
connect_bd_net -net segnumctl_0_seg_csn [get_bd_pins peri/seg_csn] [get_bd_ports seg_csn]
connect_bd_net -net segnumctl_0_seg_num [get_bd_pins peri/seg_num] [get_bd_ports seg_num]
connect_bd_net -net sin_0_1 [get_bd_ports sin_0] [get_bd_pins peri/sin_0]
connect_bd_net -net spi_sdo_0_1 [get_bd_ports spi_sdo_0] [get_bd_pins flash/spi_sdo_0]
connect_bd_net -net vga_c1_0 [get_bd_pins vga/c1] [get_bd_ports vga_c1]
connect_bd_net -net vga_c2_0 [get_bd_pins vga/c2] [get_bd_ports vga_c2]
connect_bd_net -net vga_c3_0 [get_bd_pins vga/c3] [get_bd_ports vga_c3]
connect_bd_net [get_bd_pins xlconstant_0/dout] [get_bd_pins core/int_req2] [get_bd_pins core/int_req3] [get_bd_pins core/int_req5]

# ---- address map ----
assign_bd_address -offset 0x00000000 -range 128M -target_address_space [get_bd_addr_spaces core/cpu_axi_interface_0/m0_axi] [get_bd_addr_segs ddr/mig_7series_0/memmap/memaddr]
assign_bd_address -offset 0x10000000 -range 64K -target_address_space [get_bd_addr_spaces core/cpu_axi_interface_0/m0_axi] [get_bd_addr_segs peri/axi_uart16550_0/S_AXI/Reg]
assign_bd_address -offset 0x10080000 -range 64K -target_address_space [get_bd_addr_spaces core/cpu_axi_interface_0/m0_axi] [get_bd_addr_segs flash/flashctl_0/ctl_axi/reg0]
assign_bd_address -offset 0x10100000 -range 64K -target_address_space [get_bd_addr_spaces core/cpu_axi_interface_0/m0_axi] [get_bd_addr_segs axi_ethernetlite_0/S_AXI/Reg]
assign_bd_address -offset 0x10200000 -range 4K -target_address_space [get_bd_addr_spaces core/cpu_axi_interface_0/m0_axi] [get_bd_addr_segs peri/btnctl_0/s_axi/reg0]
assign_bd_address -offset 0x11000000 -range 4K -target_address_space [get_bd_addr_spaces core/cpu_axi_interface_0/m0_axi] [get_bd_addr_segs vga/FrameReader_0/s_axi/reg0]
assign_bd_address -offset 0x11010000 -range 4K -target_address_space [get_bd_addr_spaces core/cpu_axi_interface_0/m0_axi] [get_bd_addr_segs peri/dotmtxctl_0/s_axi/reg0]
assign_bd_address -offset 0x11020000 -range 4K -target_address_space [get_bd_addr_spaces core/cpu_axi_interface_0/m0_axi] [get_bd_addr_segs peri/ledctl_0/s_axi/reg0]
assign_bd_address -offset 0x11030000 -range 4K -target_address_space [get_bd_addr_spaces core/cpu_axi_interface_0/m0_axi] [get_bd_addr_segs peri/segnumctl_0/s_axi/reg0]
assign_bd_address -offset 0x1FC00000 -range 4M -target_address_space [get_bd_addr_spaces core/cpu_axi_interface_0/m0_axi] [get_bd_addr_segs flash/flashctl_0/rw_axi/reg0]
assign_bd_address -offset 0x00000000 -range 128M -target_address_space [get_bd_addr_spaces vga/FrameReader_0/m_axi] [get_bd_addr_segs ddr/mig_7series_0/memmap/memaddr]
assign_bd_address -offset 0x1FC00000 -range 4M -target_address_space [get_bd_addr_spaces vga/FrameReader_0/m_axi] [get_bd_addr_segs flash/flashctl_0/rw_axi/reg0]
exclude_bd_addr_seg -offset 0x10000000 -range 64K -target_address_space [get_bd_addr_spaces vga/FrameReader_0/m_axi] [get_bd_addr_segs peri/axi_uart16550_0/S_AXI/Reg]
exclude_bd_addr_seg -offset 0x10080000 -range 64K -target_address_space [get_bd_addr_spaces vga/FrameReader_0/m_axi] [get_bd_addr_segs flash/flashctl_0/ctl_axi/reg0]
exclude_bd_addr_seg -offset 0x10100000 -range 64K -target_address_space [get_bd_addr_spaces vga/FrameReader_0/m_axi] [get_bd_addr_segs axi_ethernetlite_0/S_AXI/Reg]
exclude_bd_addr_seg -offset 0x10200000 -range 4K -target_address_space [get_bd_addr_spaces vga/FrameReader_0/m_axi] [get_bd_addr_segs peri/btnctl_0/s_axi/reg0]
exclude_bd_addr_seg -offset 0x11000000 -range 4K -target_address_space [get_bd_addr_spaces vga/FrameReader_0/m_axi] [get_bd_addr_segs vga/FrameReader_0/s_axi/reg0]
exclude_bd_addr_seg -offset 0x11010000 -range 4K -target_address_space [get_bd_addr_spaces vga/FrameReader_0/m_axi] [get_bd_addr_segs peri/dotmtxctl_0/s_axi/reg0]
exclude_bd_addr_seg -offset 0x11020000 -range 4K -target_address_space [get_bd_addr_spaces vga/FrameReader_0/m_axi] [get_bd_addr_segs peri/ledctl_0/s_axi/reg0]
exclude_bd_addr_seg -offset 0x11030000 -range 4K -target_address_space [get_bd_addr_spaces vga/FrameReader_0/m_axi] [get_bd_addr_segs peri/segnumctl_0/s_axi/reg0]

validate_bd_design
save_bd_design
